# EAGLE design led_matrix_4X4 (EAGLE 6.1)
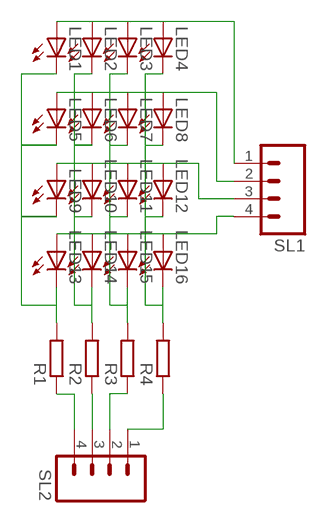
[diagram p0: schematic, sheet 1]

## Parts
LED1  LED5MM  [LED5MM]
LED2  LED5MM  [LED5MM]
LED3  LED5MM  [LED5MM]
LED4  LED5MM  [LED5MM]
LED5  LED5MM  [LED5MM]
LED6  LED5MM  [LED5MM]
LED7  LED5MM  [LED5MM]
LED8  LED5MM  [LED5MM]
LED9  LED5MM  [LED5MM]
LED10  LED5MM  [LED5MM]
LED11  LED5MM  [LED5MM]
LED12  LED5MM  [LED5MM]
LED13  LED5MM  [LED5MM]
LED14  LED5MM  [LED5MM]
LED15  LED5MM  [LED5MM]
LED16  LED5MM  [LED5MM]
R1  R-EU_0204/7  [0204/7]
R2  R-EU_0204/7  [0204/7]
R3  R-EU_0204/7  [0204/7]
R4  R-EU_0204/7  [0204/7]
SL1  M04  [04P]
SL2  M04  [04P]

## Nets
N$1: LED1.K(C) LED5.K(C) LED9.K(C) LED13.K(C) R1.2
N$5: R1.1 SL2.4
N$6: R2.1 SL2.3
N$7: R3.1 SL2.2
N$8: R4.1 SL2.1
N$9: LED1.A LED2.A LED3.A LED4.A SL1.1
N$10: LED5.A LED6.A LED7.A LED8.A SL1.2
N$11: LED9.A LED10.A LED11.A LED12.A SL1.3
N$12: LED13.A LED14.A LED15.A LED16.A SL1.4
N$14: LED2.K(C) LED6.K(C) LED10.K(C) LED14.K(C) R2.2
N$15: LED3.K(C) LED7.K(C) LED11.K(C) LED15.K(C) R3.2
N$16: LED4.K(C) LED8.K(C) LED12.K(C) LED16.K(C) R4.2

## Library data of the parts
LED1-LED16 = led:LED: LED OSRAM: - CHIPLED LG R971, LG N971, LY N971, LG Q971, LY Q971, LO R971, LY R971 LH N974, LH R974 LS Q976, LO Q976, LY Q976 LO Q996 - Hyper CHIPLED LW Q18S LB Q993, LB Q99A, LB R99A - SideLED LS A670, LO A670, LY A670, LG A670, LP A670 LB A673, LV A673, LT A673, LW A673 LH A674 LY A675 LS A676, LA A676, LO A676, LY A676, LW A676 LS A679, LY A679, LG A679 - Hyper Micro SIDELED® LS Y876, LA Y876, LO Y876, LY Y876 LT Y87S - SmartLED LW L88C, LW L88S LB L89C, LB L89S, LG L890 LS L89K, LO L89K, LY L89K LS L896, LA L896, LO L896, LY L896 - TOPLED LS T670, LO T670, LY T670, LG T670, LP T670 LSG T670, LSP T670, LSY T670, LOP T670, LYG T670 LG T671, LOG T671, LSG T671 LB T673, LV T673, LT T673, LW T673 LH T674 LS T676, LA T676, LO T676, LY T676, LB T676, LH T676, LSB T676, LW T676 LB T67C, LV T67C, LT T67C, LS T67K, LO T67K, LY T67K, LW E67C LS E67B, LA E67B, LO E67B, LY E67B, LB E67C, LV E67C, LT E67C LW T67C LS T679, LY T679, LG T679 LS T770, LO T770, LY T770, LG T770, LP T770 LB T773, LV T773, LT T773, LW T773 LH T774 LS E675, LA E675, LY E675, LS T675 LS T776, LA T776, LO T776, LY T776, LB T776 LHGB T686 LT T68C, LB T68C - Hyper Mini TOPLED® LB M676 - Mini TOPLED Santana® LG M470 LS M47K, LO M47K, LY M47K Source: http://www.osram.convergy.de LUXEON: - LUMILED® LXK2-PW12-R00, LXK2-PW12-S00, LXK2-PW14-U00, LXK2-PW14-V00 LXK2-PM12-R00, LXK2-PM12-S00, LXK2-PM14-U00 LXK2-PE12-Q00, LXK2-PE12-R00, LXK2-PE12-S00, LXK2-PE14-T00, LXK2-PE14-U00 LXK2-PB12-K00, LXK2-PB12-L00, LXK2-PB12-M00, LXK2-PB14-N00, LXK2-PB14-P00, LXK2-PB14-Q00 LXK2-PR12-L00, LXK2-PR12-M00, LXK2-PR14-Q00, LXK2-PR14-R00 LXK2-PD12-Q00, LXK2-PD12-R00, LXK2-PD12-S00 LXK2-PH12-R00, LXK2-PH12-S00 LXK2-PL12-P00, LXK2-PL12-Q00, LXK2-PL12-R00 Source: www.luxeon.com KINGBRIGHT: KA-3528ASYC Source: www.kingbright.com
R1-R4 = rcl:R-EU_: RESISTOR, European symbol
SL1 SL2 = con-amp-quick:M04: AMP QUICK CONNECTOR; OC_FARNELL: unknown; OC_NEWARK: unknown

## Board
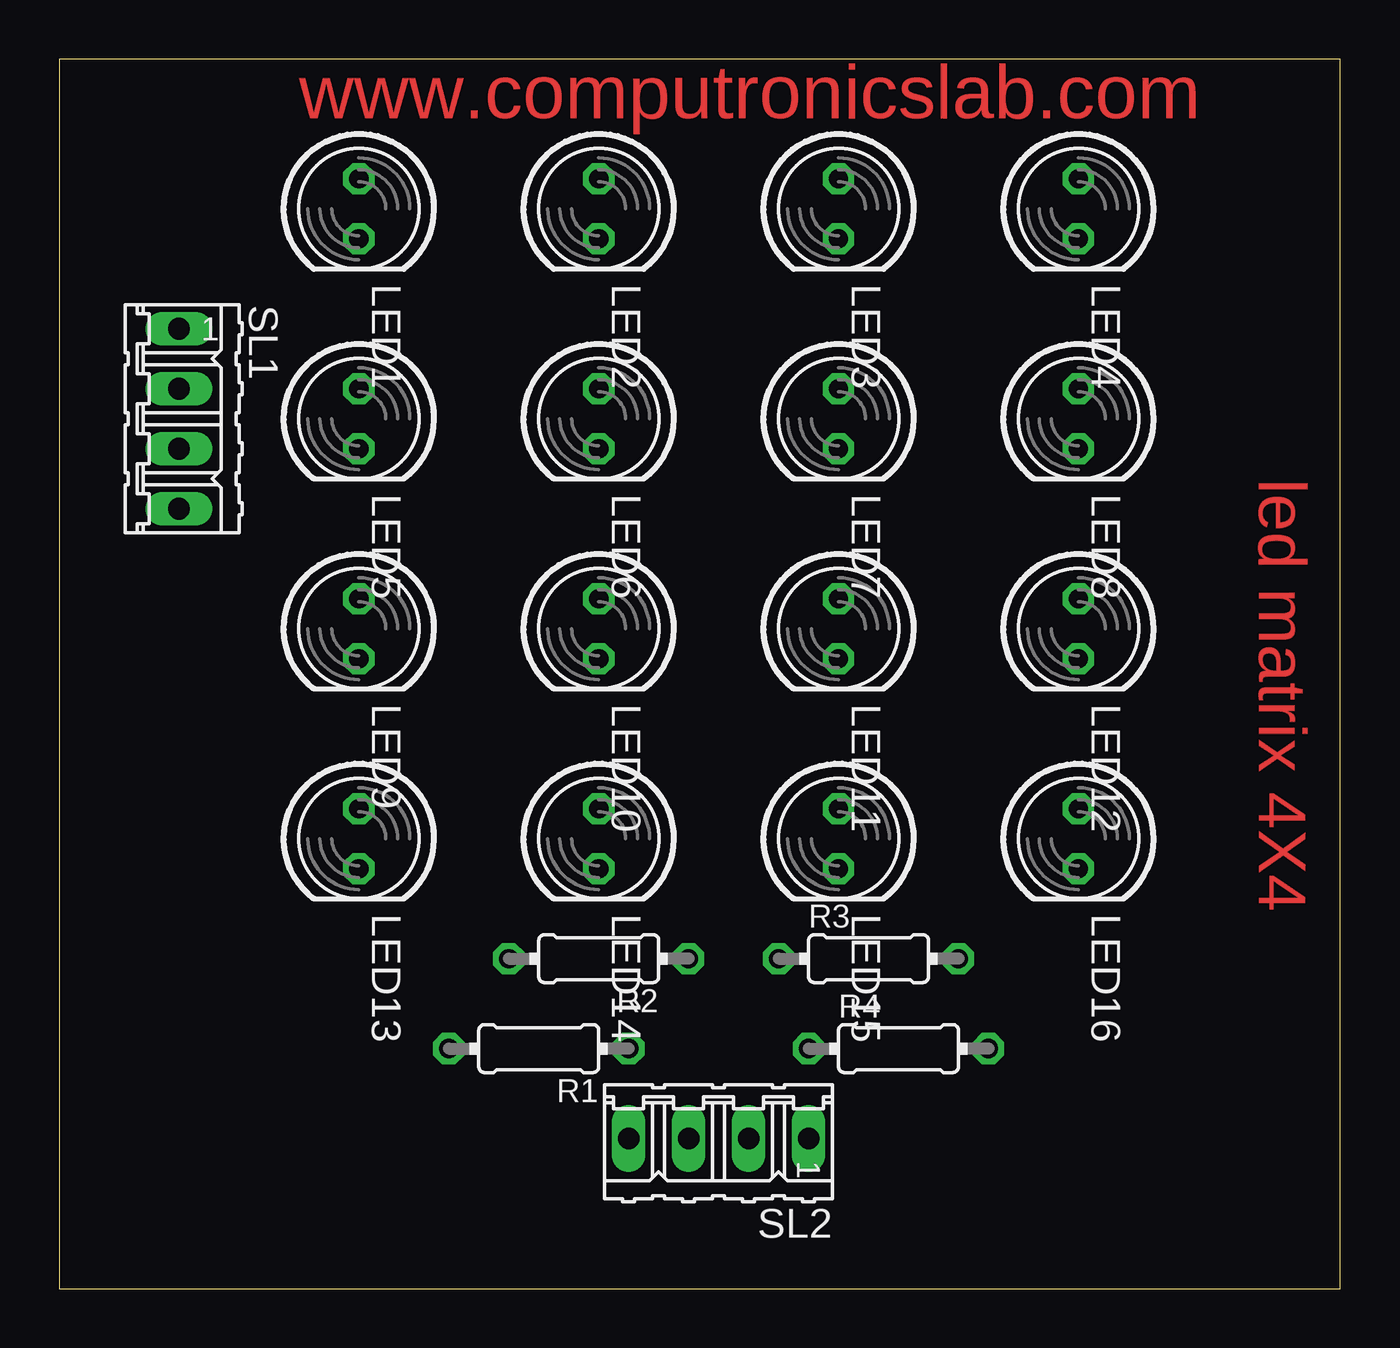
[diagram p1: board, top side]
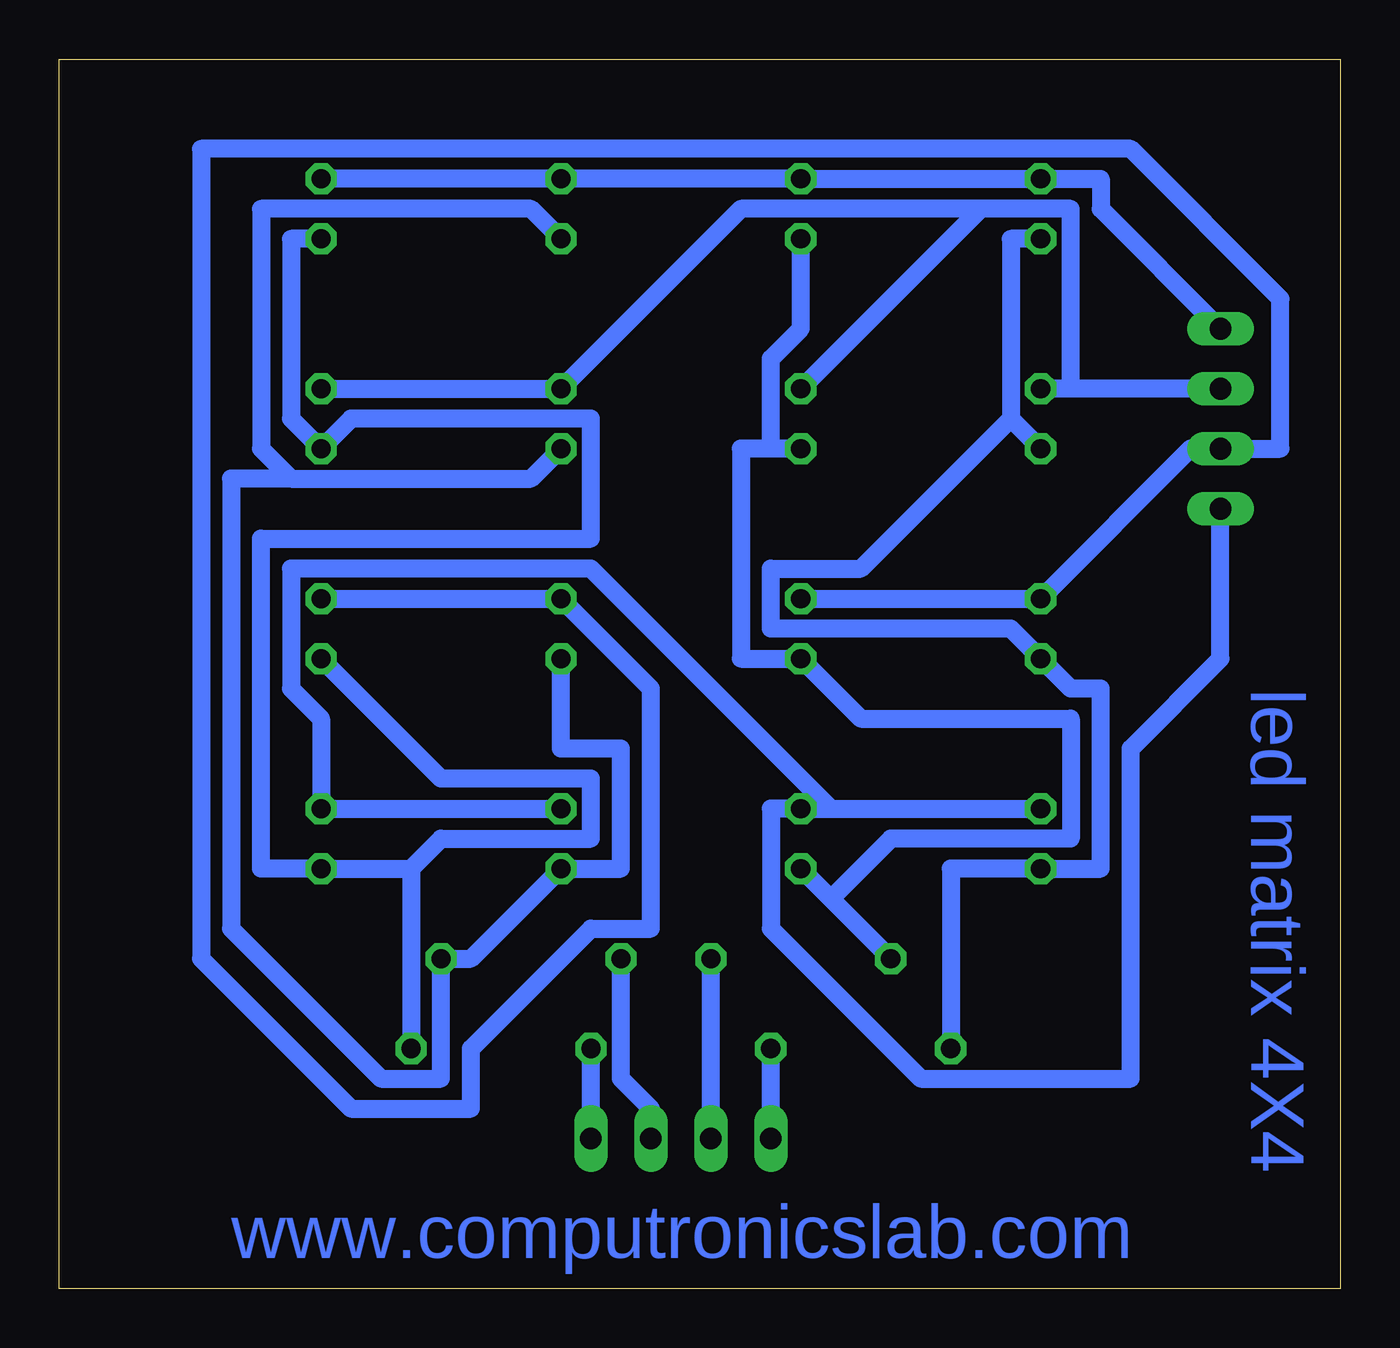
[diagram p2: board, bottom side, seen from below]

Size 54.28 x 52.06 mm. Coordinates in mm from the lower left corner, seen from the top.
Outline: 0,0 54.28,0 54.28,52.06 0,52.06 0,0
Copper layers (1*16): Top 0.035mm / dielectric 1.5mm / Bottom 0.035mm
Design rules: minimum track width 30mil, minimum drill 24mil, track to track 8mil, track to pad 8mil, pad to pad 8mil, via to via 8mil, smd to smd 8mil, copper to edge 40mil, drill to drill 8mil, minimum pad ring 10mil, minimum via ring 8mil, stop-mask expansion 4mil, vias tented up to drill 0mil, thermal gap 10mil

### Footprints (pad centres in the part's own frame; a part is rotated, then mirrored left to right if it is on the bottom)
LED5MM = drill 0.813 octagon: A -1.27,0; K 1.27,0
0204/7 = drill 0.813 octagon: 1 -3.81,0; 2 3.81,0
04P = drill 0.914 long: 1 -3.81,0; 2 -1.27,0; 3 1.27,0; 4 3.81,0

### Placement (x,y rotation side)
LED1  12.7,45.72 270 top
LED2  22.86,45.72 270 top
LED3  33.02,45.72 270 top
LED4  43.18,45.72 270 top
LED5  12.7,36.83 270 top
LED6  22.86,36.83 270 top
LED7  33.02,36.83 270 top
LED8  43.18,36.83 270 top
LED9  12.7,27.94 270 top
LED10  22.86,27.94 270 top
LED11  33.02,27.94 270 top
LED12  43.18,27.94 270 top
LED13  12.7,19.05 270 top
LED14  22.86,19.05 270 top
LED15  33.02,19.05 270 top
LED16  43.18,19.05 270 top
R1  20.32,10.16 180 top
R2  22.86,13.97 180 top
R3  34.29,13.97 0 top
R4  35.56,10.16 0 top
SL1  5.08,36.83 270 top
SL2  27.94,6.35 180 top

### Tracks (layer width: path | path; a pad name or v marks a point on that pad's centre or on a via)
N$1
  Bottom 0.762: 13.97,36.83 LED5.K | 13.97,36.83 13.97,44.45 LED1.K | R1.2 16.51,17.78 LED13.K 10.16,17.78 10.16,25.4 11.43,25.4 LED9.K 13.97,27.94 24.13,27.94 24.13,30.48 20.32,30.48 13.97,36.83
N$5
  Bottom 0.762: SL2.4 R1.1
N$6
  Bottom 0.762: SL2.3 R2.1
N$7
  Bottom 0.762: R3.1 30.48,8.89 29.21,7.62 SL2.2
N$8
  Bottom 0.762: SL2.1 R4.1
N$9
  Bottom 0.762: LED4.A LED3.A LED2.A LED1.A 10.16,46.99 10.16,45.72 SL1.1
N$10
  Bottom 0.762: LED8.A LED7.A 25.4,45.72 15.24,45.72 | SL1.2 11.43,38.1 | 11.43,38.1 LED5.A | 15.24,45.72 LED6.A | 15.24,45.72 11.43,45.72 11.43,38.1
N$11
  Bottom 0.762: LED12.A LED11.A 29.21,25.4 29.21,15.24 31.75,15.24 36.83,10.16 36.83,7.62 41.91,7.62 48.26,13.97 48.26,48.26 8.89,48.26 2.54,41.91 2.54,35.56 SL1.3 6.35,35.56 LED9.A LED10.A
N$12
  Bottom 0.762: LED15.A LED16.A 43.18,24.13 44.45,25.4 44.45,30.48 31.75,30.48 21.59,20.32 | 21.59,20.32 LED14.A 24.13,20.32 24.13,15.24 17.78,8.89 8.89,8.89 8.89,22.86 5.08,26.67 SL1.4 | 21.59,20.32 LED13.A
N$14
  Bottom 0.762: LED14.K 21.59,16.51 | 21.59,16.51 R2.2 | LED6.K 24.13,35.56 | 24.13,35.56 25.4,35.56 25.4,26.67 LED10.K 20.32,24.13 11.43,24.13 11.43,19.05 19.05,19.05 21.59,16.51 | LED2.K 22.86,40.64 24.13,39.37 24.13,35.56
N$15
  Bottom 0.762: LED11.K 33.02,22.86 30.48,22.86 30.48,17.78 LED15.K 36.83,13.97 R3.2 38.1,8.89 40.64,8.89 46.99,15.24 46.99,34.29 44.45,34.29 | LED7.K 34.29,34.29 44.45,34.29 | 44.45,34.29 45.72,35.56 45.72,45.72 34.29,45.72 LED3.K
N$16
  Bottom 0.762: LED4.K 44.45,44.45 44.45,36.83 LED8.K 41.91,36.83 31.75,36.83 31.75,31.75 45.72,31.75 45.72,17.78 LED16.K 39.37,17.78 | 39.37,17.78 R4.2 | LED12.K 38.1,21.59 31.75,21.59 31.75,19.05 38.1,19.05 39.37,17.78

### Text on the board
Top: www.computronicslab.com | led matrix 4X4
Bottom: led matrix 4X4 | www.computronicslab.com